# EasyEDA Pro project 无人机主控.epro, schematic stm32c8t6科创杯
Board Name: stm32c8t6科创杯; Create Date: 2024-12-09; Page Name: Sheet_1 copy; Schematic Name: stm32c8t6科创杯; Update Date: 2024-12-09
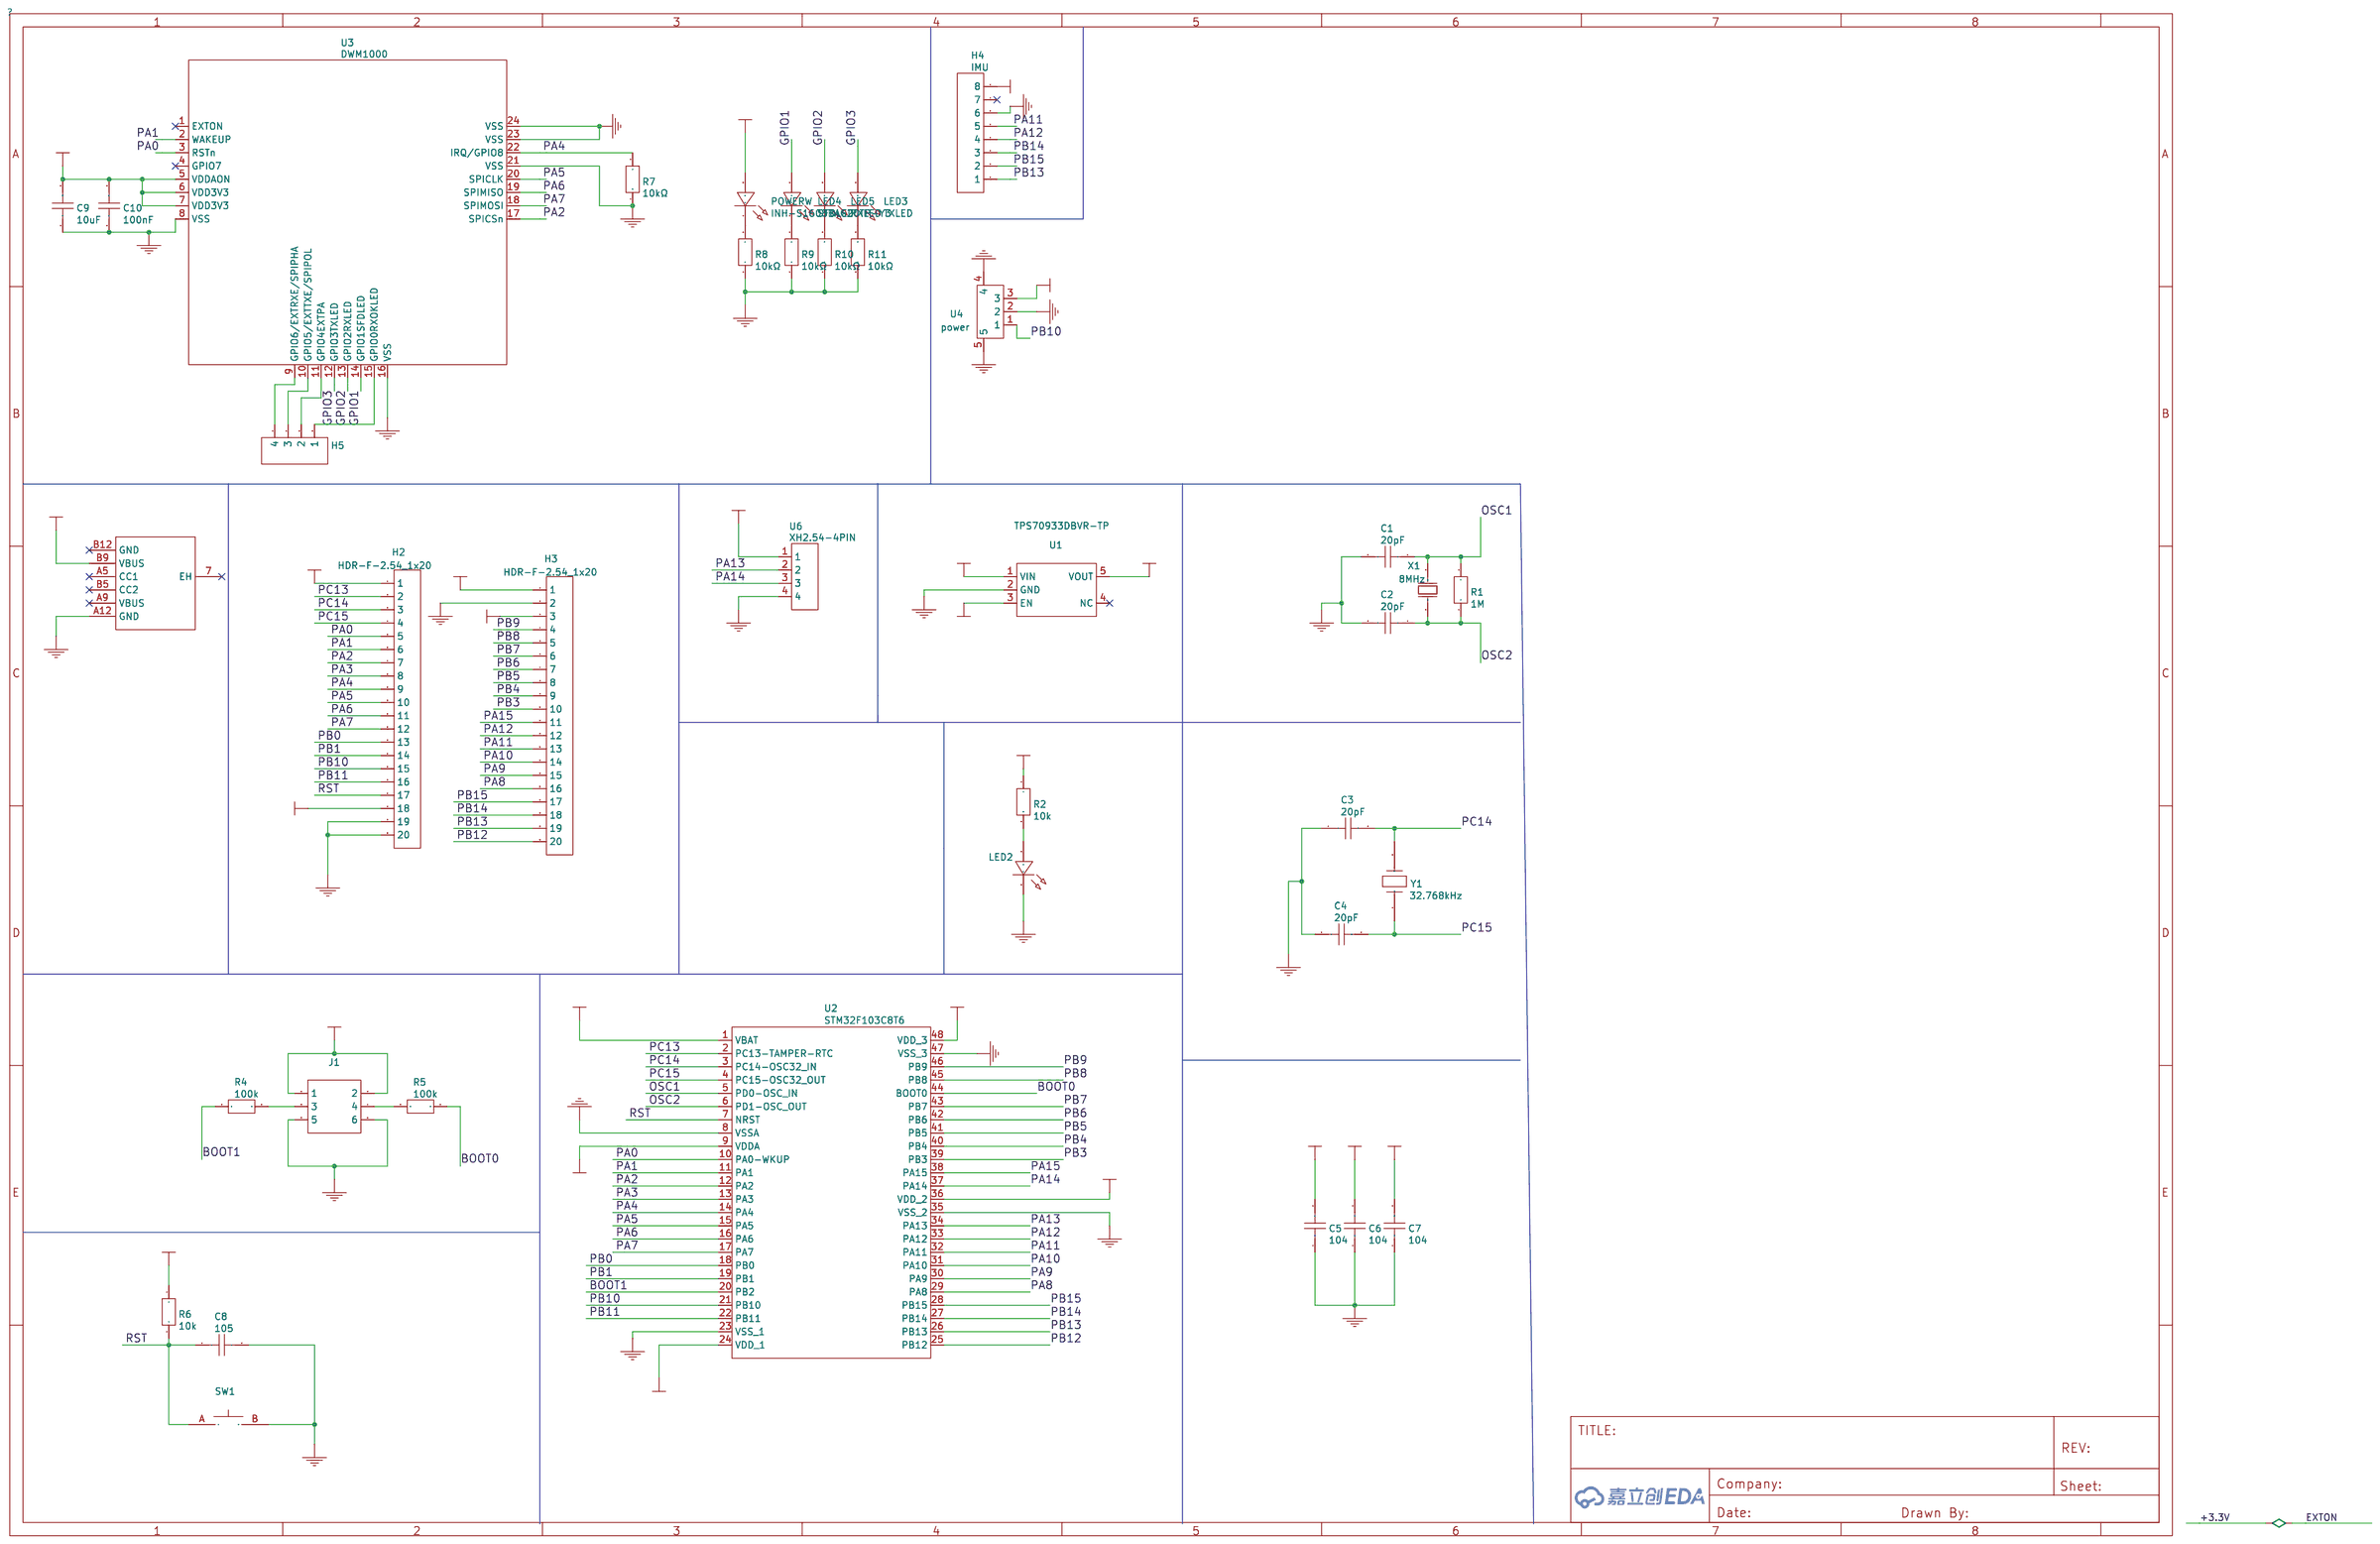
[diagram p0: schematic sheet]

## Parts
C1  20pF  [C0603]
C2  20pF  [C0603]
C3  20pF  [C0603]
C4  20pF  [C0603]
C5  104  [C0603]
C6  104  [C0603]
C7  104  [C0603]
C8  105  [C0603]
C9  10uF  [C0603]
C10  100nF  [C0603]
H2  HDR-F-2.54_1x20  [HDR-F-2.54_1X20]
H3  HDR-F-2.54_1x20  [HDR-F-2.54_1X20]
H4  IMU  [HDR-F-2.54_1X8]
H5  HDR-F-2.54_1x4  [HDR-F-2.54_1X4]
J1  HDR-M-2.54_2x3  [HDR-M-2.54_2X3]
LED2  LED-0603_R  [LED0603_RED]
LED3  TXLED  [LED0603-RD]
LED4  SFDLED  [LED0603-RD]
LED5  RXLED  [LED0603-RD]
POWERW  INH-S1608BAG20TP-Y3  [LED0603-RD]
R1  1M  [R0603]
R2  10k  [R0603]
R4  100k  [R0603]
R5  100k  [R0603]
R6  10k  [R0603]
R7  10kΩ  [R0603]
R8  10kΩ  [R0603]
R9  10kΩ  [R0603]
R10  10kΩ  [R0603]
R11  10kΩ  [R0603]
SW1  1TS002B-2500-5000  [SW-SMD_L3.5-W6.0-P8.20]
U1  TPS70933DBVR-TP  [SOT-23-5_L3.0-W1.7-P0.95-LS2.8-BR]
U2  STM32F103C8T6  [LQFP-48_L7.0-W7.0-P0.50-LS9.0-BL]
U3  DWM1000  [WIRELM-TH_DWM1000]
U4  power  [CONN-SMD_3P-P1.25-MX1.25-LT-3]
U6  XH2.54-4PIN  [CONN-TH_XH2.54-4]
USB1  TYPE-C 6P  [TYPE-C-SMD_TYPE-C-6P]
X1  8MHz  [HC-49US_L11.5-W4.5-P4.88]
Y1  32.768kHz  [SMD3215]

## Library data of the parts
C1-C4 = 20pF
C5-C7 = 104
C8 = 105
C9 = 10uF: Supplier: LCSC; Supplier Part: C15415; Manufacturer: SAMSUNG(三星); JLCPCB Part Class: Extended Part; link: https://so.szlcsc.com/global.html?k=C15415&amp;ref=editor
C10 = 100nF: Supplier: LCSC; Supplier Part: C138344; Manufacturer: null; Manufacturer Part: CT41-0603-2F4-50V-0.1uF-M(N); JLCPCB Part Class: Extended Part; link: https://so.szlcsc.com/global.html?k=C138344&amp;ref=editor
H2 H3 = HDR-F-2.54_1x20: Supplier Part: C50984; Supplier: LCSC
H4 = IMU: Supplier Part: C225505; Supplier: LCSC
H5 = HDR-F-2.54_1x4: Supplier Part: C225501; Supplier: LCSC
J1 = HDR-M-2.54_2x3: Supplier Part: C65114; Supplier: LCSC
LED2 = LED-0603_R: Manufacturer: EVERLIGHT(台湾亿光); Manufacturer Part: 19-217/R6C-AL1M2VY/3T; Supplier Part: C72044; Supplier: LCSC
LED3 = TXLED: Supplier: LCSC; Supplier Part: C9900003101; Manufacturer: null; Manufacturer Part: INH-S1608BAG20TP-Y3; link: https://so.szlcsc.com/global.html?k=C9900003101&amp;ref=editor
LED4 = SFDLED: Supplier: LCSC; Supplier Part: C9900003101; Manufacturer: null; Manufacturer Part: INH-S1608BAG20TP-Y3; link: https://so.szlcsc.com/global.html?k=C9900003101&amp;ref=editor
LED5 = RXLED: Supplier: LCSC; Supplier Part: C9900003101; Manufacturer: null; Manufacturer Part: INH-S1608BAG20TP-Y3; link: https://so.szlcsc.com/global.html?k=C9900003101&amp;ref=editor
POWERW = INH-S1608BAG20TP-Y3: Supplier: LCSC; Supplier Part: C9900003101; Manufacturer: null; link: https://so.szlcsc.com/global.html?k=C9900003101&amp;ref=editor
R1 = 1M
R2 R6 = 10k
R4 R5 = 100k
R7-R11 = 10kΩ: Supplier: LCSC; Supplier Part: C6460716; Manufacturer: YAGEO(国巨); Manufacturer Part: RT0603FRE1010KL; JLCPCB Part Class: Extended Part; link: https://so.szlcsc.com/global.html?k=C6460716&amp;ref=editor
SW1 = 1TS002B-2500-5000: Supplier: LCSC; Supplier Part: C255792; Manufacturer: HYP(鸿源精密)
U1 = TPS70933DBVR-TP: Supplier: LCSC; Supplier Part: C2937032; Manufacturer: TECH PUBLIC(台舟); JLCPCB Part Class: Extended Part
U2 = STM32F103C8T6: Supplier: LCSC; Manufacturer: ST(意法半导体); Supplier Part: C8734; JLCPCB Part Class: Basic Part
U3 = DWM1000: Supplier: LCSC; Manufacturer: decaWave; Supplier Part: C95238; JLCPCB Part Class: Extended Part; link: https://so.szlcsc.com/global.html?k=C95238&amp;ref=editor
U4 = power: Supplier: LCSC; Supplier Part: C9900097986; Manufacturer: null; Manufacturer Part: MX1.25-LT-3; link: https://so.szlcsc.com/global.html?k=C9900097986&amp;ref=editor
U6 = XH2.54-4PIN: Supplier: LCSC; Supplier Part: C9900014913; Manufacturer: null; link: https://so.szlcsc.com/global.html?k=C9900014913&amp;ref=editor
USB1 = TYPE-C 6P: Supplier: LCSC; Supplier Part: C456012; Manufacturer: SHOU HAN; JLCPCB Part Class: Extended Part
X1 = 8MHz: Supplier: LCSC; Manufacturer: HOSONIC(鸿星); Manufacturer Part: E49A25E000013E10C0; Supplier Part: C116092; JLCPCB Part Class: Extended Part
Y1 = 32.768kHz: 料号: 1301.00017; 描述: 贴片晶体 9HT10-32.768KEZF-T SMD3215 3.2×1.5mm; 原厂/原厂型号: TXC CORPORATION/9HT10-32.768KEZF-T

## Nets
+3.3V: C6.2 C7.2 C9.2 C10.2 H2.18 H3.1 H4.8 J1.1 J1.2 POWERW.2 R2.1 R6.1 U1.5(VOUT) U2.9(VDDA) U2.24(VDD_1) U2.36(VDD_2) U2.48(VDD_3) U3.5(VDDAON) U3.6(VDD3V3) U3.7(VDD3V3) U6.1
+5V: C5.2 H2.1 H3.3 U1.1(VIN) U1.3(EN) U2.1(VBAT) U4.3 USB1.B9(VBUS)
GND: C1.2 C2.2 C3.1 C4.1 C5.1 C6.1 C7.1 C8.2 C9.1 C10.1 H2.19 H2.20 H3.2 H4.6 J1.5 J1.6 LED2.2 R7.1 R8.1 R9.1 R10.1 R11.1 SW1.B U1.2(GND) U2.8(VSSA) U2.23(VSS_1) U2.35(VSS_2) U2.47(VSS_3) U3.8(VSS) U3.16(VSS) U3.21(VSS) U3.23(VSS) U3.24(VSS) U4.2 U4.4 U4.5 U6.4 USB1.A12(GND)
BOOT0: R5.1 U2.44(BOOT0)
BOOT1: R4.1 U2.20(PB2)
GPIO1: LED4.2 U3.14(GPIO1SFDLED)
GPIO2: LED5.2 U3.13(GPIO2RXLED)
GPIO3: LED3.2 U3.12(GPIO3TXLED)
OSC1: C1.1 R1.2 U2.5(PD0-OSC_IN) X1.2(OSC2)
OSC2: C2.1 R1.1 U2.6(PD1-OSC_OUT) X1.1(OSC1)
PA0: H2.5 U2.10(PA0-WKUP) U3.3(RSTn)
PA1: H2.6 U2.11(PA1) U3.2(WAKEUP)
PA2: H2.7 U2.12(PA2) U3.17(SPICSn)
PA3: H2.8 U2.13(PA3)
PA4: H2.9 R7.2 U2.14(PA4) U3.22(IRQ/GPIO8)
PA5: H2.10 U2.15(PA5) U3.20(SPICLK)
PA6: H2.11 U2.16(PA6) U3.19(SPIMISO)
PA7: H2.12 U2.17(PA7) U3.18(SPIMOSI)
PA8: H3.16 U2.29(PA8)
PA9: H3.15 U2.30(PA9)
PA10: H3.14 U2.31(PA10)
PA11: H3.13 H4.5 U2.32(PA11)
PA12: H3.12 H4.4 U2.33(PA12)
PA13: U2.34(PA13) U6.2
PA14: U2.37(PA14) U6.3
PA15: H3.11 U2.38(PA15)
PB0: H2.13 U2.18(PB0)
PB1: H2.14 U2.19(PB1)
PB3: H3.10 U2.39(PB3)
PB4: H3.9 U2.40(PB4)
PB5: H3.8 U2.41(PB5)
PB6: H3.7 U2.42(PB6)
PB7: H3.6 U2.43(PB7)
PB8: H3.5 U2.45(PB8)
PB9: H3.4 U2.46(PB9)
PB10: H2.15 U2.21(PB10) U4.1
PB11: H2.16 U2.22(PB11)
PB12: H3.20 U2.25(PB12)
PB13: H3.19 H4.1 U2.26(PB13)
PB14: H3.18 H4.3 U2.27(PB14)
PB15: H3.17 H4.2 U2.28(PB15)
PC13: H2.2 U2.2(PC13-TAMPER-RTC)
PC14: C3.2 H2.3 U2.3(PC14-OSC32_IN) Y1.2
PC15: C4.2 H2.4 U2.4(PC15-OSC32_OUT) Y1.1
RST: C8.1 H2.17 R6.2 SW1.A U2.7(NRST)
$1N8: J1.4 R5.2
$1N11: J1.3 R4.2
$1N97: H5.4 U3.9(GPIO6/EXTRXE/SPIPHA)
$1N98: H5.3 U3.10(GPIO5/EXTTXE/SPIPOL)
$1N99: H5.2 U3.11(GPIO4EXTPA)
$1N100: H5.1 U3.15(GPIO0RXOKLED)
$1N1126: POWERW.1 R8.2
Net-(LED2-1): LED2.1 R2.2
Net-(LED3-1): LED3.1 R11.2
Net-(LED4-1): LED4.1 R9.2
Net-(LED5-1): LED5.1 R10.2

Not connected (* = marked no-connect by the designer): H4 7*; U1 4(NC)*; U3 1(EXTON)* 4(GPIO7)*; USB1 7(EH)* A5(CC1)* A9(VBUS)* B5(CC2)* B12(GND)*
